# Altium schematic sheet CPU.SchDoc
size A4; SheetNumber: 6; SheetTotal: 7
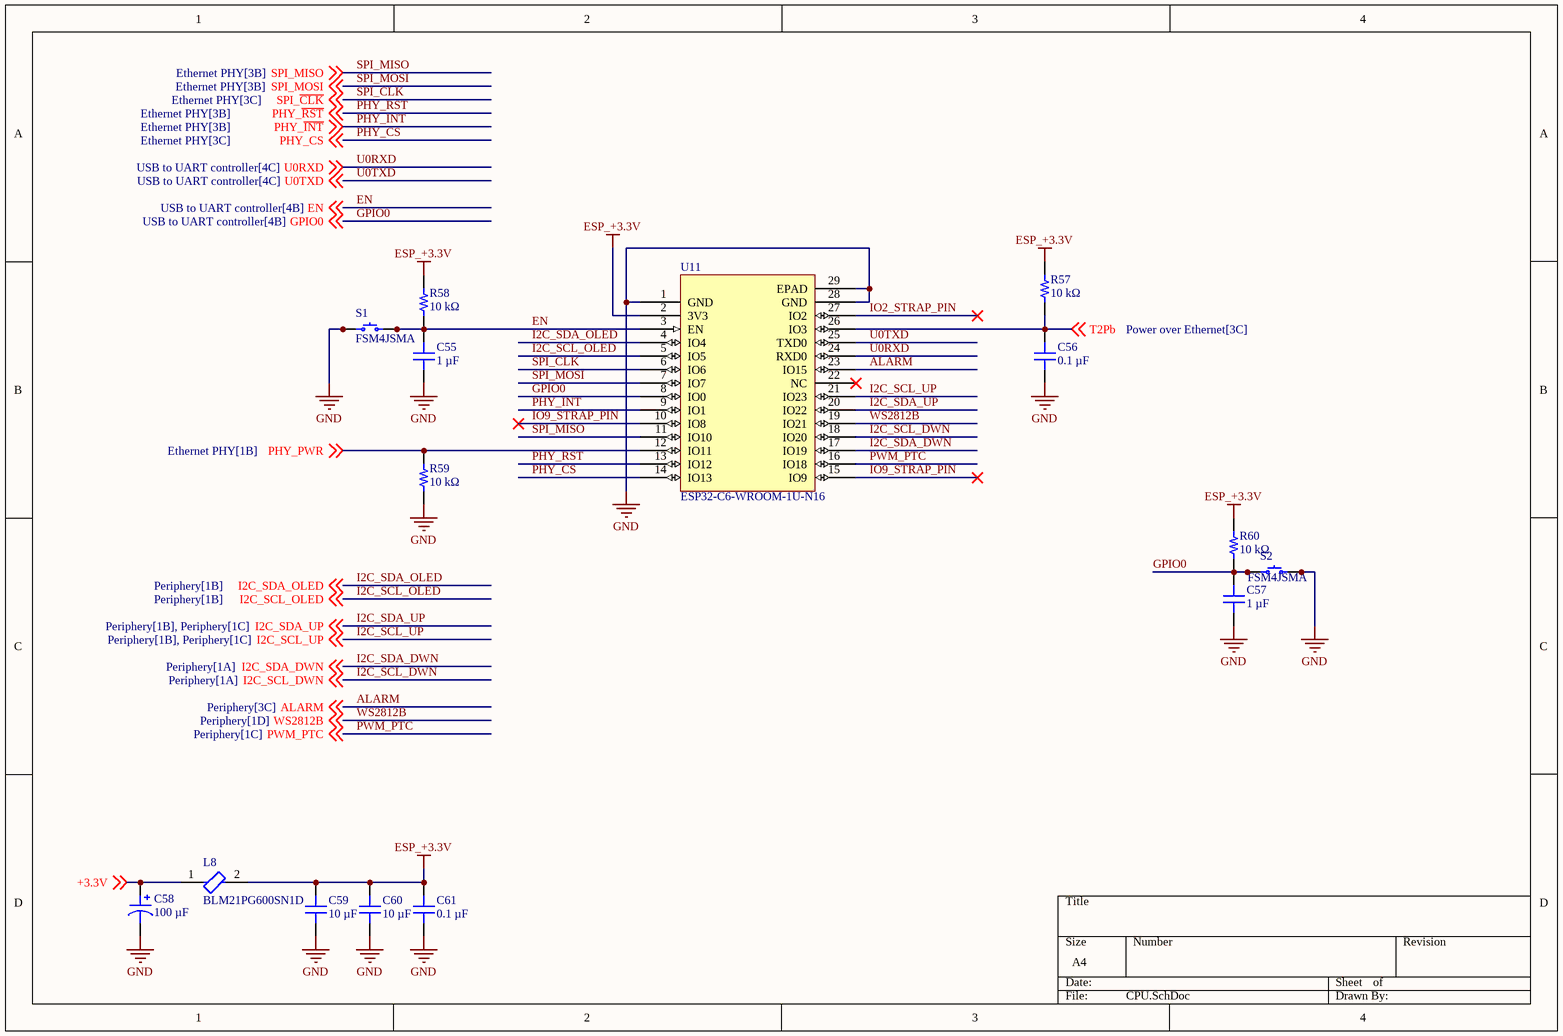
[diagram p0: CPU.SchDoc]

## Parts
C55  1 µF  [CAP 0805_2012]
C56  0.1 µF  [CAP 0603_1608]
C57  1 µF  [CAP 0805_2012]
C58  100 µF  [CAP POL 1411_3528]
C59  10 µF  [CAP 0805_2012]
C60  10 µF  [CAP 0805_2012]
C61  0.1 µF  [CAP 0603_1608]
L8  BLM21PG600SN1D  [FP-BLM21-0_2-t0_85-e0_5-d-IPC_A]
R57  10 kΩ  [RES 0603_1608]
R58  10 kΩ  [RES 0603_1608]
R59  10 kΩ  [RES 0603_1608]
R60  10 kΩ  [RES 0603_1608]
S1  FSM4JSMA  [TE FSM4JSMA]
S2  FSM4JSMA  [TE FSM4JSMA]
U11  ESP32-C6-WROOM-1U-N16  [ESP32-C6-WROOM-1U]

## Nets
ESP_+3.3V: C59.2 C60.2 C61.2 L8.2 R57.2 R58.2 R60.2 U11.2(3V3)
GND: C55.1 C56.1 C57.1 C58.2 C59.1 C60.1 C61.1 R59.1 S1.1 S1.2 S2.3 S2.4 U11.1(GND) U11.28(GND) U11.29(EPAD)
+3.3V: C58.1 L8.1 ; off-sheet +3.3V
ALARM: U11.23(IO15) ; off-sheet ALARM
EN: C55.2 R58.1 S1.3 S1.4 U11.3(EN) ; off-sheet EN
GPIO0: C57.2 R60.1 S2.1 S2.2 U11.8(IO0) ; off-sheet GPIO0
I2C_SCL_DWN: U11.18(IO20) ; off-sheet I2C_SCL_DWN
I2C_SCL_OLED: U11.5(IO5) ; off-sheet I2C_SCL_OLED
I2C_SCL_UP: U11.21(IO23) ; off-sheet I2C_SCL_UP
I2C_SDA_DWN: U11.17(IO19) ; off-sheet I2C_SDA_DWN
I2C_SDA_OLED: U11.4(IO4) ; off-sheet I2C_SDA_OLED
I2C_SDA_UP: U11.20(IO22) ; off-sheet I2C_SDA_UP
IO2_STRAP_PIN: U11.27(IO2)
IO9_STRAP_PIN: U11.10(IO8) U11.15(IO9)
PHY_CS: U11.14(IO13) ; off-sheet PHY_CS
PHY_~{INT}: U11.9(IO1) ; off-sheet PHY_~{INT}
PHY_PWR: R59.2 U11.12(IO11) ; off-sheet PHY_PWR
PHY_~{RST}: U11.13(IO12) ; off-sheet PHY_~{RST}
PWM_PTC: U11.16(IO18) ; off-sheet PWM_PTC
SPI_~{CLK}: U11.6(IO6) ; off-sheet SPI_~{CLK}
SPI_MISO: U11.11(IO10) ; off-sheet SPI_MISO
SPI_MOSI: U11.7(IO7) ; off-sheet SPI_MOSI
T2Pb: C56.2 R57.1 U11.26(IO3) ; off-sheet T2Pb
U0RXD: U11.24(RXD0) ; off-sheet U0RXD
U0TXD: U11.25(TXD0) ; off-sheet U0TXD
WS2812B: U11.19(IO21) ; off-sheet WS2812B

Not connected (* = marked no-connect by the designer): U11 22(NC)*

## Library data of the parts
C55 C57 = C2012X7R1E105K125AB: CAP CER 1UF 25V X7R 0805; manufacturer: TDK Corporation; Tolerance: ±10%; Part Number: C2012X7R1E105K125AB; Capacitance: 1 µF; Applications: General Purpose; componentlink1description: Datasheet; componentlink1url: https://product.tdk.com/info/en/catalog/datasheets/mlcc_commercial_general_en.pdf?ref_disty=digikey; componentlink2description: DigiKey Link; componentlink2url: https://www.digikey.com/en/products/detail/tdk-corporation/C2012X7R1E105K125AB/513887; Device Package: 0805 (2012 Metric); Features: Low ESL; lastupdated: 9.02.2024 20:15:16; Lifecycle Status: Active; Minimum Order: 1; Mounting Type: Surface Mount, MLCC; Operating Temperature: -55°C ~ 125°C; Package / Case: 0805 (2012 Metric); packaging: TapeAndReel; partid: 33961; Part Status: Active; price: 0.03; series: C; Size / Dimension: 0.079" L x 0.049" W (2.00mm x 1.25mm); Supplier 1: DigiKey; Supplier Part Number 1: 445-1354-1-ND; Temperature Coefficient: X7R; Thickness (Max): 0.057" (1.45mm); value: 1 µF; Voltage - Rated: 25V
C56 C61 = C1608X7R1H104K080AE: CAP CER 0.1UF 50V X7R 0603; manufacturer: TDK Corporation; Tolerance: ±10%; Part Number: C1608X7R1H104K080AE; Capacitance: 0.1 µF; Applications: Boardflex Sensitive; componentlink1description: Datasheet; componentlink1url: https://product.tdk.com/info/en/catalog/datasheets/mlcc_commercial_soft_en.pdf?ref_disty=digikey; componentlink2description: DigiKey Link; componentlink2url: https://www.digikey.com/en/products/detail/tdk-corporation/C1608X7R1H104K080AE/4490564; Device Package: 0603 (1608 Metric); Features: Soft Termination; lastupdated: 9.02.2024 20:10:17; Lifecycle Status: Active; Minimum Order: 1; Mounting Type: Surface Mount, MLCC; Operating Temperature: -55°C ~ 125°C; Package / Case: 0603 (1608 Metric); packaging: TapeAndReel; partid: 12789; Part Status: Active; price: 0.02; series: C; Size / Dimension: 0.063" L x 0.031" W (1.60mm x 0.80mm); Supplier 1: DigiKey; Supplier Part Number 1: 445-15927-6-ND; Temperature Coefficient: X7R; Thickness (Max): 0.037" (0.95mm); value: 0.1 µF; Voltage - Rated: 50V
C58 = T494B107M006AT: CAP TANT 100UF 20% 6.3V 1411; manufacturer: KEMET; Manufacturer Size Code: B; ESR (Equivalent Series Resistance): 1.5Ohm; Lifetime @ Temp.: 2000 Hrs @ 125°C; Type: Molded; Part Number: T494B107M006AT; Value: 100 µF; Capacitance: 100 µF; componentlink1description: Datasheet; componentlink1url: https://api.kemet.com/component-edge/download/datasheet/T494B107M006AT.pdf; componentlink2description: DigiKey Link; componentlink2url: https://www.digikey.com/en/products/detail/kemet/T494B107M006AT/818693; Device Package: 1411 (3528 Metric); Features: General Purpose; Height - Seated (Max): 0.083" (2.10mm); lastupdated: 3.06.2024 19:29:03; Lifecycle Status: Active; Minimum Order: 1; Mounting Type: Surface Mount; Operating Temperature: -55°C ~ 125°C; Package / Case: 1411 (3528 Metric); packaging: TapeAndReel; partid: 7; Part Status: Active; price: 0.49; series: T494; Size / Dimension: 0.138" L x 0.110" W (3.50mm x 2.80mm); Supplier 1: DigiKey; Supplier Part Number 1: 399-3833-1-ND; Tolerance: ±20%; Voltage - Rated: 6.3 V
C59 C60 = CGA4J1X7R0J106K125AC: CAP CER 10UF 6.3V X7R 0805; manufacturer: TDK Corporation; Tolerance: ±10%; Part Number: CGA4J1X7R0J106K125AC; Capacitance: 10 µF; Applications: Automotive; componentlink1description: Datasheet; componentlink1url: https://product.tdk.com/info/en/catalog/datasheets/mlcc_automotive_general_en.pdf?ref_disty=digikey; componentlink2description: DigiKey Link; componentlink2url: https://www.digikey.com/en/products/detail/tdk-corporation/CGA4J1X7R0J106K125AC/2672864; Device Package: 0805 (2012 Metric); lastupdated: 9.02.2024 20:16:07; Lifecycle Status: Active; Minimum Order: 1; Mounting Type: Surface Mount, MLCC; Operating Temperature: -55°C ~ 125°C; Package / Case: 0805 (2012 Metric); packaging: TapeAndReel; partid: 3016; Part Status: Active; price: 0.06; Ratings: AEC-Q200; series: CGA; Size / Dimension: 0.079" L x 0.049" W (2.00mm x 1.25mm); Supplier 1: DigiKey; Supplier Part Number 1: 445-6971-1-ND; Temperature Coefficient: X7R; Thickness (Max): 0.057" (1.45mm); value: 10 µF; Voltage - Rated: 6.3V
L8 = CMP-0686-00616-3: Chip Ferrite Bead, 0805, 60Ω @ 100MHz, 0.02Ω, 25%, 3.5A; DC Resistance-Max: 20mR; Number of Circuits: 1; Impedance: 60R; DC Current: 3A; Shielding: Unshielded; Material: Steel; Military Standard: Not; DC Resistance (DCR): 20mR; Core Material: Ferrite; Termination: SMD/SMT; Max Operating Temperature: 125°C; Max Current Rating: 3.5A; Length: 2mm; Packaging: Tape and Reel; Case Code (Metric): 2012; Series: BLM21P; REACH SVHC: No SVHC; Width: 1.25mm; Current Rating: 3.5A; Height: 0.85mm; RoHS Compliant: Yes; Case Code (Imperial): 0805; Radiation Hardening: No; Frequency: 100MHz; Package Quantity: 1; Depth: 1.25mm; Tolerance: 25%; Number of Lines: 1; Lead Free: Lead Free; Case/Package: 0805; Min Operating Temperature: -55°C; Max DC Current: 3A; Number of Pins: 2; Test Frequency: 100MHz
R57-R60 = CRCW060310K0FKEA: RES SMD 10K OHM 1% 1/10W 0603; Manufacturer: Vishay Dale; Power (Watts): 0.1W, 1/10W; Resistance: 10 kOhms; Temperature Coefficient: ±100ppm/°C; Part Number: CRCW060310K0FKEA; Value: 10 kΩ; ComponentLink1Description: Datasheet; ComponentLink1URL: http://www.vishay.com/docs/20035/dcrcwe3.pdf; ComponentLink2Description: DigiKey Link; ComponentLink2URL: https://www.digikey.com/en/products/detail/vishay-dale/CRCW060310K0FKEA/1174782; Composition: Thick Film; Device Package: 0603 (1608 Metric); Features: Automotive AEC-Q200; Height - Seated (Max): 0.020" (0.50mm); LastUpdated: 9.02.2024 20:42:10; Lifecycle Status: Active; Minimum Order: 1; Number of Terminations: 2; Operating Temperature: -55°C ~ 155°C; Package / Case: 0603 (1608 Metric); Packaging: CutTape; PartId: 24636; Part Status: Active; Price: 0.01; Ratings: AEC-Q200; Series: CRCW; Size / Dimension: 0.061" L x 0.033" W (1.55mm x 0.85mm); Supplier 1: DigiKey; Supplier Part Number 1: 541-10.0KHCT-ND; Supplier Device Package: 0603; Tolerance: ±1%
S1 S2 = FSM4JSMA: SWITCH TACTILE SPST-NO 0.05A 24V; Manufacturer: TE Connectivity ALCOSWITCH Switches; Actuator Height off PCB, Vertical: 5.00mm; Actuator Orientation: Top Actuated; Actuator Type: Standard; Contact Rating @ Voltage: 0.05A @ 24VDC; Illumination: Non-Illuminated; Operating Force: 160gf; Outline: 6.00mm x 6.00mm; Switch Function: Off-Mom; Part Number: FSM4JSMA; Circuit: SPST-NO; ComponentLink1Description: Datasheet; ComponentLink1URL: https://www.te.com/commerce/DocumentDelivery/DDEController?Action=srchrtrv&DocNm=1308111-1_SWITCHES_CORE_PROGRAM_CATALOG&DocType=CS&DocLang=English; ComponentLink2Description: DigiKey Link; ComponentLink2URL: https://www.digikey.com/en/products/detail/te-connectivity-alcoswitch-switches/FSM4JSMA/525821; LastUpdated: 3.06.2024 20:19:31; Lifecycle Status: Active; Minimum Order: 1; Mounting Type: Surface Mount; Operating Temperature: -35°C ~ 85°C; Packaging: Bulk; Part Status: Active; Price: 0.14; Series: FSMJSMA; Supplier 1: DigiKey; Supplier Part Number 1: 450-1129-ND; Termination Style: Gull Wing
U11 = ESP32-C6-WROOM-1U-N16: Supplier 1: TME; Supplier Part Number 1: ESP32C6-WROOM1UN16